# Altium project bms_mainboard-1_0.PrjPcb (part 3 of 7)

## Sheet adc_mcp3913.SchDoc
size A
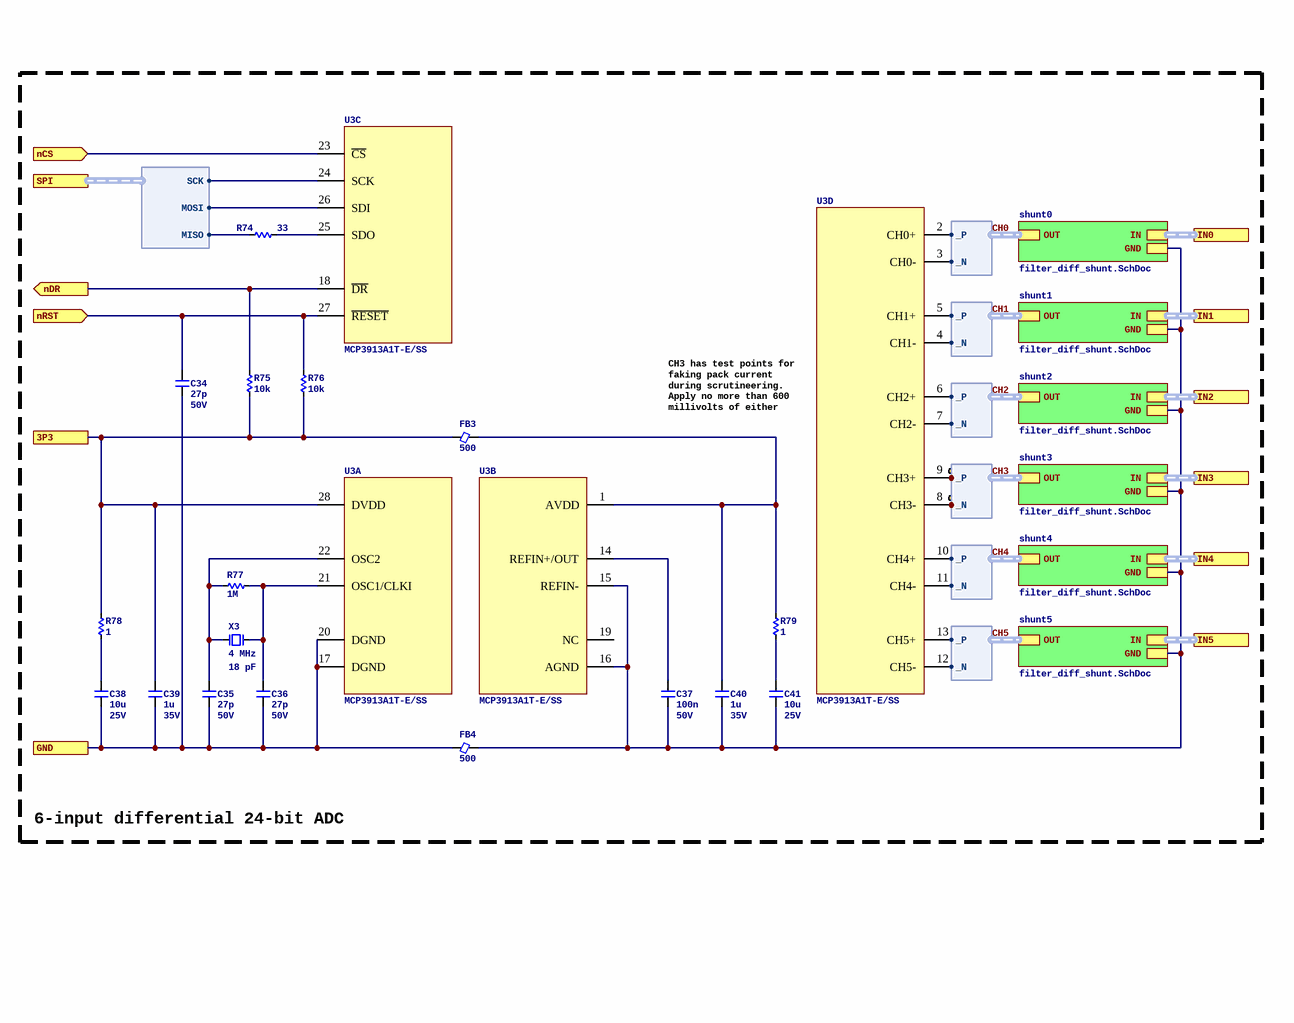
[diagram p9: adc_mcp3913.SchDoc]

### Parts
C34  Capacitance: 27p  Voltage Rating: 50V  [C0402]  (hidden comment: 0402CG270J500NT)
C35  Capacitance: 27p  Voltage Rating: 50V  [C0402]  (hidden comment: 0402CG270J500NT)
C36  Capacitance: 27p  Voltage Rating: 50V  [C0402]  (hidden comment: 0402CG270J500NT)
C37  Capacitance: 100n  Voltage Rating: 50V  [C0402]  (hidden comment: CL05B104KB54PNC)
C38  Capacitance: 10u  Voltage Rating: 25V  [C0805]  (hidden comment: CL21B106KAYQNNE)
C39  Capacitance: 1u  Voltage Rating: 35V  [C0603]  (hidden comment: GMK107AB7105KAHT)
C40  Capacitance: 1u  Voltage Rating: 35V  [C0603]  (hidden comment: GMK107AB7105KAHT)
C41  Capacitance: 10u  Voltage Rating: 25V  [C0805]  (hidden comment: CL21B106KAYQNNE)
FB3  Current Rating (mA): 500  [FB0402]  (hidden comment: BLM15AX601SN1D)
FB4  Current Rating (mA): 500  [FB0402]  (hidden comment: BLM15AX601SN1D)
R74  value 33  [R0402]  (hidden comment: 0402WGF330JTCE)
R75  value 10k  [R0402]  (hidden comment: 0402WGF1002TCE)
R76  value 10k  [R0402]  (hidden comment: 0402WGF1002TCE)
R77  value 1M  [R0402]  (hidden comment: 0402WGF1004TCE)
R78  value 1  [R0402]  (hidden comment: CRCW04021R00FKED)
R79  value 1  [R0402]  (hidden comment: CRCW04021R00FKED)
TP71  RH-5000  [TP_RH-5000]  (value not drawn)
TP72  RH-5001  [TP_RH-5001]  (value not drawn)
U3  MCP3913A1T-E/SS  [28SSOP65]  (parts A,B,C,D of 4)
X3  Frequency: 4 MHz  Load Capacitance: 18 pF  [XTAL_HC49US_SMD]  (hidden comment: ABLS2-4.000MHZ-D4Y-T)

### Blocks framed on the sheet
6-input differential 24-bit ADC: C34-C41 FB3 FB4 R74-R79 TP71 TP72 U3 X3

### Sub-sheets
shunt0 = filter_diff_shunt.SchDoc: IN (harness DIFF), OUT (harness DIFF), GND
shunt1 = filter_diff_shunt.SchDoc: IN (harness DIFF), OUT (harness DIFF), GND
shunt2 = filter_diff_shunt.SchDoc: IN (harness DIFF), OUT (harness DIFF), GND
shunt3 = filter_diff_shunt.SchDoc: IN (harness DIFF), OUT (harness DIFF), GND
shunt4 = filter_diff_shunt.SchDoc: IN (harness DIFF), OUT (harness DIFF), GND
shunt5 = filter_diff_shunt.SchDoc: IN (harness DIFF), OUT (harness DIFF), GND

### Ports
3P3, GND, IN0 (harness DIFF), IN1 (harness DIFF), IN2 (harness DIFF), IN3 (harness DIFF), IN4 (harness DIFF), IN5 (harness DIFF), nCS (in), nDR (out), nRST (in), SPI (harness SPI)

### Harnesses
DIFF: _N, _P
SPI: MISO, MOSI, SCK

### Nets
3P3_B: C39.1 FB3.1 R75.2 R76.2 R78.2 U3.28(DVDD) ; port 3P3
HV_N: C34.2 C35.2 C36.2 C38.2 C39.2 FB4.1 U3.17(DGND) U3.20(DGND) ; port GND
CH0._N: U3.3(CH0-) ; sheet shunt0/OUT._N
CH0._P: U3.2(CH0+) ; sheet shunt0/OUT._P
CH1._N: U3.4(CH1-) ; sheet shunt1/OUT._N
CH1._P: U3.5(CH1+) ; sheet shunt1/OUT._P
CH2._N: U3.7(CH2-) ; sheet shunt2/OUT._N
CH2._P: U3.6(CH2+) ; sheet shunt2/OUT._P
CH3._N: TP72.1 U3.8(CH3-) ; sheet shunt3/OUT._N
CH3._P: TP71.1 U3.9(CH3+) ; sheet shunt3/OUT._P
CH4._N: U3.11(CH4-) ; sheet shunt4/OUT._N
CH4._P: U3.10(CH4+) ; sheet shunt4/OUT._P
CH5._N: U3.12(CH5-) ; sheet shunt5/OUT._N
CH5._P: U3.13(CH5+) ; sheet shunt5/OUT._P
MCP3913_nDR_ISO: R75.1 U3.18(~{DR}) ; port nDR
MCP3913_nRST_ISO: C34.1 R76.1 U3.27(~{RESET}) ; port nRST
SPI4_ISO.MISO: R74.2 ; port SPI.MISO
SPI4_ISO.MOSI: U3.26(SDI) ; port SPI.MOSI
SPI4_ISO.SCK: U3.24(SCK) ; port SPI.SCK
SPI4_nSS_ISO: U3.23(~{CS}) ; port nCS
NetC35_1: C35.1 R77.2 U3.22(OSC2) X3.2
NetC36_1: C36.1 R77.1 U3.21(OSC1/CLKI) X3.1
NetC37_1: C37.1 U3.14(REFIN+/OUT)
NetC37_2: C37.2 C40.2 C41.2 FB4.2 U3.15(REFIN-) U3.16(AGND) ; sheet shunt0/GND, sheet shunt1/GND, sheet shunt2/GND, sheet shunt3/GND, sheet shunt4/GND, sheet shunt5/GND
NetC38_1: C38.1 R78.1
NetC40_1: C40.1 FB3.2 R79.2 U3.1(AVDD)
NetC41_1: C41.1 R79.1
NetR74_1: R74.1 U3.25(SDO)

Not connected (* = marked no-connect by the designer): U3 19(NC)

### Buses and harness runs
harness CH0 = sheet shunt0/OUT
harness CH1 = sheet shunt1/OUT
harness CH2 = sheet shunt2/OUT
harness CH3 = sheet shunt3/OUT
harness CH4 = sheet shunt4/OUT
harness CH5 = sheet shunt5/OUT
harness port IN0 = sheet shunt0/IN
harness port IN1 = sheet shunt1/IN
harness port IN2 = sheet shunt2/IN
harness port IN3 = sheet shunt3/IN
harness port IN4 = sheet shunt4/IN
harness port IN5 = sheet shunt5/IN

### Notes on the sheet
- CH3 has test points for faking pack current during scrutineering. Apply no more than 600 millivolts of either polarity.

### Library data of the parts
C34-C36 = 0402CG270J500NT: Manufacturer: FH(Guangdong Fenghua Advanced Tech); Dielectric: C0G; ComponentLink1URL: https://wmsc.lcsc.com/wmsc/upload/file/pdf/v2/lcsc/2304140030_FH--Guangdong-Fenghua-Advanced-Tech-0402CG270J500NT_C1557.pdf; ComponentLink1Description: Datasheet; Manufacturer Part Number: 0402CG270J500NT; Package: 0402; Supplier 2: LCSC; Supplier Part Number 2: C1557
C37 = CL05B104KB54PNC: Manufacturer: Samsung Electro-Mechanics; Dielectric: X7R; ComponentLink1URL: https://wmsc.lcsc.com/wmsc/upload/file/pdf/v2/lcsc/2304140030_Samsung-Electro-Mechanics-CL05B104KB54PNC_C307331.pdf; ComponentLink1Description: Datasheet; Manufacturer Part Number: CL05B104KB54PNC; Package: 0402; Supplier 2: LCSC; Supplier Part Number 2: C307331
C38 C41 = CL21B106KAYQNNE: Manufacturer: Samsung Electro-Mechanics; Dielectric: X7R; ComponentLink1URL: https://datasheet.lcsc.com/lcsc/2206222030_Samsung-Electro-Mechanics-CL21B106KAYQNNE_C3039694.pdf; ComponentLink1Description: Datasheet; Manufacturer Part Number: CL21B106KAYQNNE; Package: 0805; Supplier 2: LCSC; Supplier Part Number 2: C3039694
C39 C40 = GMK107AB7105KAHT: Manufacturer: Taiyo Yuden; Dielectric: X7R; ComponentLink1URL: https://datasheet.lcsc.com/lcsc/2304140030_Taiyo-Yuden-GMK107AB7105KAHT_C841050.pdf; ComponentLink1Description: Datasheet; Manufacturer Part Number: GMK107AB7105KAHT; Package: 0603; Supplier 2: LCSC; Supplier Part Number 2: C841050
FB3 FB4 = BLM15AX601SN1D: Manufacturer: Murata Electronics; Z @ 100 MHz: 600; DCR (mOhms): 340; ComponentLink1URL: https://wmsc.lcsc.com/wmsc/upload/file/pdf/v2/lcsc/2304140030_Murata-Electronics-BLM15AX601SN1D_C76886.pdf; ComponentLink1Description: Datasheet; Manufacturer Part Number: BLM15AX601SN1D; Supplier 2: LCSC; Supplier Part Number 2: C76886; Package: 0402
R74 = 0402WGF330JTCE: Manufacturer: UNI-ROYAL(Uniroyal Elec); Tolerance: 1%; Temperature Coefficient: Â±100ppm/â„ƒ; Power Rating (mW): 62.5; ComponentLink1Description: Datasheet; ComponentLink1URL: https://wmsc.lcsc.com/wmsc/upload/file/pdf/v2/lcsc/2205311900_UNI-ROYAL-Uniroyal-Elec-0402WGF330JTCE_C25105.pdf; Manufacturer Part Number: 0402WGF330JTCE; Package: 0402; Supplier 2: LCSC; Supplier Part Number 2: C25105
R75 R76 = 0402WGF1002TCE: Manufacturer: UNI-ROYAL(Uniroyal Elec); Tolerance: 1%; Temperature Coefficient: Â±100ppm/â„ƒ; Power Rating (mW): 62.5; ComponentLink1Description: Datasheet; ComponentLink1URL: https://wmsc.lcsc.com/wmsc/upload/file/pdf/v2/lcsc/2206010100_UNI-ROYAL-Uniroyal-Elec-0402WGF1002TCE_C25744.pdf; Manufacturer Part Number: 0402WGF1002TCE; Package: 0402; Supplier 2: LCSC; Supplier Part Number 2: C25744
R77 = 0402WGF1004TCE: Manufacturer: UNI-ROYAL(Uniroyal Elec); Tolerance: 1%; Temperature Coefficient: Â±100ppm/â„ƒ; Power Rating (mW): 62.5; ComponentLink1Description: Datasheet; ComponentLink1URL: https://wmsc.lcsc.com/wmsc/upload/file/pdf/v2/lcsc/2206010030_UNI-ROYAL-Uniroyal-Elec-0402WGF1004TCE_C26083.pdf; Manufacturer Part Number: 0402WGF1004TCE; Package: 0402; Supplier 2: LCSC; Supplier Part Number 2: C26083
R78 R79 = CRCW04021R00FKED: Manufacturer: Vishay Intertech; Tolerance: 1%; Temperature Coefficient: Â±100ppm/â„ƒ; Power Rating (mW): 63; ComponentLink1Description: Datasheet; ComponentLink1URL: https://wmsc.lcsc.com/wmsc/upload/file/pdf/v2/lcsc/2211030200_Vishay-Intertech-CRCW04021R00FKED_C482087.pdf; Manufacturer Part Number: CRCW04021R00FKED; Package: 0402; Supplier 2: LCSC; Supplier Part Number 2: C482087
TP71 = RH-5000: Manufacturer: ronghe; ComponentLink1Description: Datasheet; ComponentLink1URL: https://datasheet.lcsc.com/lcsc/2307040929_ronghe-RH-5000_C5277086.pdf; Manufacturer Part Number: RH-5000; Supplier 2: LCSC; Supplier Part Number 2: C5277086
TP72 = RH-5001: Manufacturer: ronghe; ComponentLink1Description: Datasheet; ComponentLink1URL: https://datasheet.lcsc.com/lcsc/2307040929_ronghe-RH-5000_C5277086.pdf; Manufacturer Part Number: RH-5001; Supplier 2: LCSC; Supplier Part Number 2: C5199801
U3 = ADC_MCP3913A1T-E/SS: Analog Circuit, 1 Func, PDSO28; Manufacturer: Microchip; Manufacturer Part Number: MCP3913A1T-E/SS; ComponentLink2URL: https://ww1.microchip.com/downloads/en/DeviceDoc/MCP3913-3V-Six-Channel-Analog-Front-End-DS20005227C.pdf; ComponentLink2Description: Datasheet; Supplier 1: Digikey; Supplier Part Number 1: MCP3913A1T-E/SSCT-ND; Supplier 2: LCSC; Supplier Part Number 2: C628828
X3 = XTAL_ABLS2-4.000MHZ-D4Y-T: CRYSTAL 4.000 MHZ 18PF SMD; Manufacturer: Abracon LLC; Supplier 1: Digikey; Manufacturer Part Number: ABLS2-4.000MHZ-D4Y-T; ComponentLink1URL: http://www.abracon.com/Resonators/ABLS2.pdf; ComponentLink1Description: Datasheet; Supplier Part Number 1: 535-9857-1-ND; Supplier 2: LCSC; Supplier Part Number 2: C5933228

## Sheet filter_diff_shunt.SchDoc
size A
Used 6 times, as channels adc_mcp3913/shunt0, adc_mcp3913/shunt1, adc_mcp3913/shunt2, adc_mcp3913/shunt3, adc_mcp3913/shunt4, adc_mcp3913/shunt5. Parts and nets are listed once, with the designators drawn on the sheet.
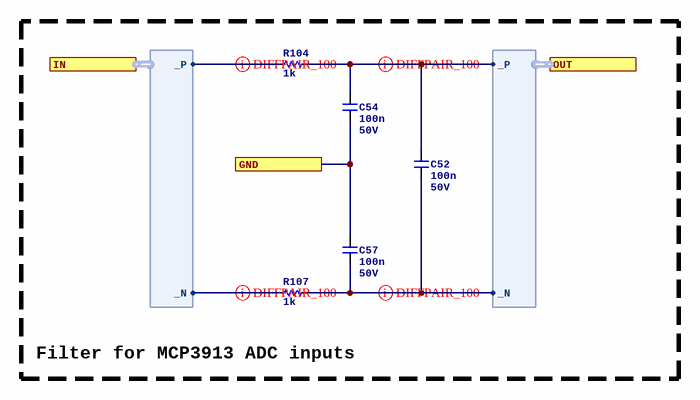
[diagram p10: filter_diff_shunt.SchDoc]

### Parts
C52  Capacitance: 100n  Voltage Rating: 50V  [C0402]  (hidden comment: CL05B104KB54PNC)
C54  Capacitance: 100n  Voltage Rating: 50V  [C0402]  (hidden comment: CL05B104KB54PNC)
C57  Capacitance: 100n  Voltage Rating: 50V  [C0402]  (hidden comment: CL05B104KB54PNC)
R104  value 1k  [R0402]  (hidden comment: 0402WGF1001TCE)
R107  value 1k  [R0402]  (hidden comment: 0402WGF1001TCE)

### Blocks framed on the sheet
Filter for MCP3913 ADC inputs: C52 C54 C57 R104 R107

### Ports
GND, IN (harness DIFF), OUT (harness DIFF)

### Harnesses
DIFF: _N, _P

### Nets
GND: C54.2 C57.1 ; port GND
NetC52_1: C52.1 C54.1 R104.1 ; port OUT._P
NetC52_2: C52.2 C57.2 R107.1 ; port OUT._N
NetR104_2: R104.2 ; port IN._P
NetR107_2: R107.2 ; port IN._N

### Channels
adc_mcp3913/shunt0: designators end in A; ports GND=NetC37_2
adc_mcp3913/shunt1: designators end in B; ports GND=NetC37_2
adc_mcp3913/shunt2: designators end in C; ports GND=NetC37_2
adc_mcp3913/shunt3: designators end in D; ports GND=NetC37_2
adc_mcp3913/shunt4: designators end in E; ports GND=NetC37_2
adc_mcp3913/shunt5: designators end in F; ports GND=NetC37_2

### Layout directives
differential pair; differential pair class DE_100: CH0._N, CH0._P, DCDC_IS._N, DCDC_IS._P

### Library data of the parts
C52 C54 C57 = CL05B104KB54PNC: as C37 on sheet adc_mcp3913; ComponentLink1URL: https://wmsc.lcsc.com/wmsc/upload/file/pdf/v2/lcsc/2304140030_Samsung-Electro-Mechanics-CL05B104KB54PNC_C307331.pdf; ComponentLink1Description: Datasheet; Manufacturer Part Number: CL05B104KB54PNC; Package: 0402; Supplier 2: LCSC; Supplier Part Number 2: C307331
R104 R107 = 0402WGF1001TCE: Manufacturer: UNI-ROYAL(Uniroyal Elec); Tolerance: 1%; Temperature Coefficient: Â±100ppm/â„ƒ; Power Rating (mW): 62.5; ComponentLink1Description: Datasheet; ComponentLink1URL: https://wmsc.lcsc.com/wmsc/upload/file/pdf/v2/lcsc/2206010216_UNI-ROYAL-Uniroyal-Elec-0402WGF1001TCE_C11702.pdf; Manufacturer Part Number: 0402WGF1001TCE; Package: 0402; Supplier 2: LCSC; Supplier Part Number 2: C11702

## Sheet hv_architecture.SchDoc
size B; SheetNumber: 3
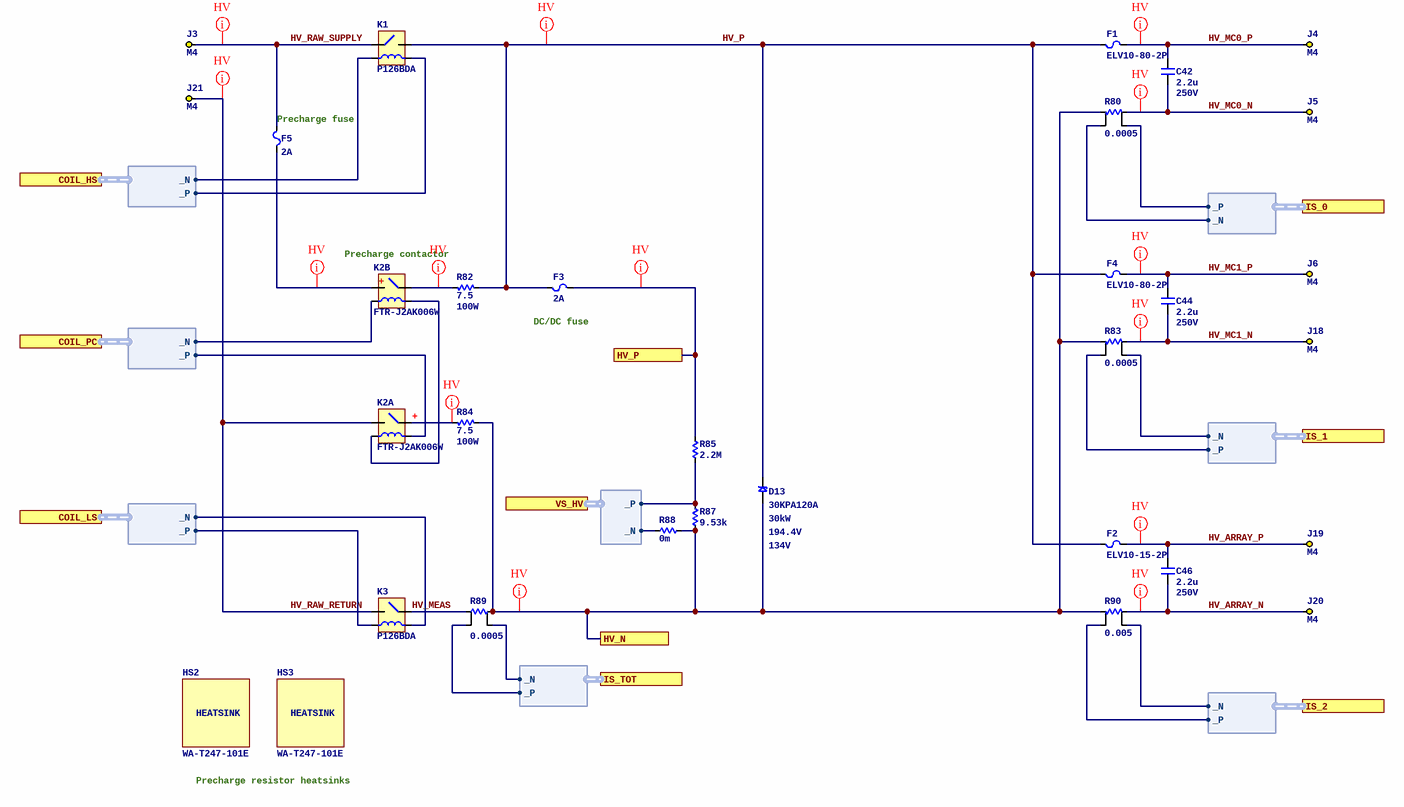
[diagram p11: hv_architecture.SchDoc]

### Parts
C42  Capacitance: 2.2u  Voltage Rating: 250V  [C2220]  (hidden comment: C5750X7T2E225KT000N)
C44  Capacitance: 2.2u  Voltage Rating: 250V  [C2220]  (hidden comment: C5750X7T2E225KT000N)
C46  Capacitance: 2.2u  Voltage Rating: 250V  [C2220]  (hidden comment: C5750X7T2E225KT000N)
D13  30KPA120A  Non-rep Peak Rev Power Dis-Max: 30kW  Clamping Voltage-Max: 194.4V  Min Breakdown Voltage: 134V  [P600_VERTICAL]
F1  ELV10-80-2P  [EATON_ELV10-xx-2P]
F2  ELV10-15-2P  [EATON_ELV10-xx-2P]
F3  Current: 2A  [BELFUSE_0ZRE0200FF]  (hidden comment: 0ZRE0200FF1A)
F4  ELV10-80-2P  [EATON_ELV10-xx-2P]
F5  Current: 2A  [BELFUSE_0ZRE0200FF]  (hidden comment: 0ZRE0200FF1A)
HS2  WA-T247-101E  (mechanical)
HS3  WA-T247-101E  (mechanical)
J3  Thread Size: M4  [WURTH_TERM_7461086]  (hidden comment: 7461086)
J4  Thread Size: M4  [WURTH_TERM_7461086]  (hidden comment: 7461086)
J5  Thread Size: M4  [WURTH_TERM_7461086]  (hidden comment: 7461086)
J6  Thread Size: M4  [WURTH_TERM_7461086]  (hidden comment: 7461086)
J18  Thread Size: M4  [WURTH_TERM_7461086]  (hidden comment: 7461086)
J19  Thread Size: M4  [WURTH_TERM_7461086]  (hidden comment: 7461086)
J20  Thread Size: M4  [WURTH_TERM_7461086]  (hidden comment: 7461086)
J21  Thread Size: M4  [WURTH_TERM_7461086]  (hidden comment: 7461086)
K1  P126BDA  [RELAY_P126]
K2  FTR-J2AK006W  [RELAY_FTR-J2]  (parts A,B of 2)
K3  P126BDA  [RELAY_P126]
R80  Resistance (Ohms): 0.0005  [VISHAY_WSL2726]  (hidden comment: WSL2726L5000FEB)
R82  Resistance (Ohms): 7.5  Power (Watts): 100W  [TO-247-2 w Ohmite heatsink]  (hidden comment: TEH100M7R50FE)
R83  Resistance (Ohms): 0.0005  [VISHAY_WSL2726]  (hidden comment: WSL2726L5000FEB)
R84  Resistance (Ohms): 7.5  Power (Watts): 100W  [TO-247-2 w Ohmite heatsink]  (hidden comment: RES_7.5_OHM_100W_1%_TO247)
R85  value 2.2M  [R1206]  (hidden comment: RC1206FR-072M2L)
R87  value 9.53k  [R0402]  (hidden comment: 0402WGF9531TCE)
R88  value 0m  [R0402]  (hidden comment: 0402WGF0000TCE)
R89  Resistance (Ohms): 0.0005  [VISHAY_WSL2726]  (hidden comment: WSL2726L5000FEB)
R90  Resistance (Ohms): 0.005  [VISHAY_WSL2726]  (hidden comment: WSL27265L000FEB)

### Ports
COIL_HS (harness DIFF), COIL_LS (harness DIFF), COIL_PC (harness DIFF), HV_N, HV_P, IS_0 (harness DIFF), IS_1 (harness DIFF), IS_2 (harness DIFF), IS_TOT (harness DIFF), VS_HV (harness DIFF)

### Harnesses
DIFF: _N, _P

### Nets
HV_N: D13.1 R80.2 R83.2 R84.2 R87.2 R88.2 R89.2 R90.2 ; port HV_N
HV_P: F3.2 R85.1 ; port HV_P
ARRAY_IS._N: R90.3 ; port IS_2._N
ARRAY_IS._P: R90.4 ; port IS_2._P
BATT_IS._N: R89.4 ; port IS_TOT._N
BATT_IS._P: R89.3 ; port IS_TOT._P
COIL_HS._N: K1.1 ; port COIL_HS._N
COIL_HS._P: K1.2 ; port COIL_HS._P
COIL_LS._N: K3.1 ; port COIL_LS._N
COIL_LS._P: K3.2 ; port COIL_LS._P
COIL_PC._N: K2.4 ; port COIL_PC._N
COIL_PC._P: K2.1 ; port COIL_PC._P
HV_ARRAY_N: C46.2 J20.0 R90.1  [project net HV_ARRAY_N_3]
HV_ARRAY_P: C46.1 F2.2 J19.0  [project net HV_ARRAY_P_3]
HV_MC0_N: C42.2 J5.0 R80.1  [project net HV_MC0_N_3]
HV_MC0_P: C42.1 F1.2 J4.0  [project net HV_MC0_P_3]
HV_MC1_N: C44.2 J18.0 R83.1  [project net HV_MC1_N_3]
HV_MC1_P: C44.1 F4.2 J6.0  [project net HV_MC1_P_3]
HV_MEAS: K3.4 R89.1  [project net HV_MEAS_3]
HV_P: D13.2 F1.1 F2.1 F3.1 F4.1 K1.3 R82.2  [project net HV_P_3]  [a separate net that carries the same name]
HV_RAW_RETURN: J21.0 K2.6 K3.3  [project net HV_RAW_RETURN_3]
HV_RAW_SUPPLY: F5.1 J3.0 K1.4  [project net HV_RAW_SUPPLY_3]
HV_VS._N: R88.1 ; port VS_HV._N
HV_VS._P: R85.2 R87.1 ; port VS_HV._P
MC0_IS._N: R80.4 ; port IS_0._N
MC0_IS._P: R80.3 ; port IS_0._P
MC1_IS._N: R83.3 ; port IS_1._N
MC1_IS._P: R83.4 ; port IS_1._P
NetF5_2: F5.2 K2.8
NetK2_2: K2.2 K2.3
NetK2_5: K2.5 R84.1
NetK2_7: K2.7 R82.1

### Layout directives
net class HV: HV_ARRAY_N_3, HV_ARRAY_P_3, HV_MC0_N_3, HV_MC0_P_3, HV_MC1_N_3, HV_MC1_P_3, HV_N, HV_P, HV_P_3, HV_RAW_RETURN_3, HV_RAW_SUPPLY_3, NetF5_2, NetK2_5, NetK2_7

### Notes on the sheet
- (near F5) Precharge fuse
- Precharge contactor
- (near F3) DC/DC fuse
- Precharge resistor heatsinks
- (in symbol HEATSINK_OHMITE_WA-T247-101E) HEATSINK
- (in symbol RELAY_FTR-J2AK006W, part A) +
- (in symbol RELAY_FTR-J2AK006W, part B) +
- (in symbol FTR-J2AK006W, part A) +
- (in symbol FTR-J2AK006W, part B) +
- (in symbol WA-T247-101E) HEATSINK

### Library data of the parts
C42 C44 C46 = C5750X7T2E225KT000N: Manufacturer: TDK; Dielectric: X7T; ComponentLink1URL: https://wmsc.lcsc.com/wmsc/upload/file/pdf/v2/lcsc/2304140030_TDK-C5750X7T2E225KT000N_C435266.pdf; ComponentLink1Description: Datasheet; Manufacturer Part Number: C5750X7T2E225KT000N; Package: 2220; Supplier 2: LCSC; Supplier Part Number 2: C435266
D13 = TVS_UNI_30KPA120A: Trans Voltage Suppressor Diode, 30000W, 120V V(RWM), Unidirectional, 1 Element, Silicon; Manufacturer: Littelfuse; Supplier 1: Digikey; Supplier Part Number 1: 30KPA120A-ND; Manufacturer Part Number: 30KPA120A; ComponentLink1URL: https://mm.digikey.com/Volume0/opasdata/d220001/medias/docus/4180/30KPA_Series.pdf; ComponentLink1Description: Datasheet; Supplier 2: LCSC; Supplier Part Number 2: C1984717
F1 F4 = FUSE_EATON_ELV10-80-2P: FUSE EV 80A 200VDC 2P TERM; Manufacturer: Eaton; Supplier 1: Digikey; Supplier Part Number 1: 283-ELV10-80-2P-ND; Manufacturer Part Number: ELV10-80-2P; ComponentLink1Description: Datasheet; ComponentLink1URL: https://www.eaton.com/content/dam/eaton/products/electronic-components/resources/data-sheet/eaton-elv10-10x25mm-ev-fuse-data-sheet-elx1302-en.pdf
F2 = FUSE_EATON_ELV10-15-2P: 15A 200 VDC Fuse Cartridge Through Hole; Manufacturer: Eaton; Supplier 1: Digikey; Supplier Part Number 1: 283-ELV10-15-2P-ND; Manufacturer Part Number: ELV10-15-2P; ComponentLink1Description: Datasheet; ComponentLink1URL: https://www.eaton.com/content/dam/eaton/products/electronic-components/resources/data-sheet/eaton-elv10-10x25mm-ev-fuse-data-sheet-elx1302-en.pdf
F3 F5 = PTC_BELFUSE_0ZRE0200FF1A: Polymeric PTC Resettable Fuse 240V 2 A Ih Through Hole Radial, Disc; Manufacturer: Bel Fuse Inc.; Supplier 1: Digikey; Supplier Part Number 1: 5923-0ZRE0200FF1A-ND; Manufacturer Part Number: 0ZRE0200FF1A; Supplier 2: LCSC; ComponentLink1Description: Datasheet; ComponentLink1URL: https://www.belfuse.com/media/datasheets/products/circuit-protection/ds-cp-0zre-series.pdf
HS2 HS3 = HEATSINK_OHMITE_WA-T247-101E: Heat Sink, 11ohm, Extruded, Clip, Longitudinal, Aluminum Alloy, Anodized; Manufacturer: Ohmite; Supplier 1: Digikey; Supplier Part Number 1: WA-T247-101E-ND; Manufacturer Part Number: WA-T247-101E; ComponentLink1Description: Datasheet; ComponentLink1URL: https://www.ohmite.com/assets/images/sink-w.pdf
J3-J6 J18-J21 = CONN_WURTH_7461086: POWER ELEMENT BUSH M4 12PIN; Manufacturer: Wurth Electronics; Supplier 1: Digikey; Supplier Part Number 1: 732-3207-ND; Manufacturer Part Number: 7461086
K1 K3 = RELAY_P126BDA: RELAY GEN PURPOSE SPST 60A 12V; Manufacturer: Sensata; Supplier 1: Digikey; Supplier Part Number 1: 3596-P126BDA-ND; Manufacturer Part Number: P126BDA; Supplier 2: Mouser; Supplier Part Number 2: 682-P126BDA; ComponentLink1Description: Datasheet; ComponentLink1URL: https://www.sensata.com/sites/default/files/a/sensata-gigavac-p126-series-minitactor-contactors-datasheet.pdf
K2 = RELAY_FTR-J2AK006W: General Purpose Relay 450VDC/10A; Manufacturer: Fujitsu; Supplier 1: Verical; Supplier Part Number 1: FTR-J2AK006W; Manufacturer Part Number: FTR-J2AK006W; ComponentLink1URL: https://www.fcl-components.com/downloads/MICRO/fcai/relays/ftr-j2.pdf; ComponentLink1Description: Datasheet; Supplier 2: Mouser; Supplier Part Number 2: 817-FTR-J2AK006W
R80 R83 R89 = RES_CURRENT_SENSE_0.0005_OHM_1%_3W_2726_WSL2726L5000FEB: RES SMD 0.0005 OHM 1% 3W 2726; Manufacturer: Vishay Dale; Supplier 1: Digikey; Manufacturer Part Number: WSL2726L5000FEB; ComponentLink1URL: http://www.vishay.com/docs/30131/wsl2726.pdf; ComponentLink1Description: Datasheet; Supplier Part Number 1: WSLQ-.0005CT-ND; Supplier 2: LCSC; Supplier Part Number 2: C4132421
R82 = RES_7.5_OHM_100W_1%_TO247: RES TK FM 7.5 OHM 100W 1% TO247; Manufacturer: Ohmite; Supplier 1: Digikey; Manufacturer Part Number: TEH100M7R50FE; ComponentLink1URL: http://www.ohmite.com/cat/res_teh100.pdf; ComponentLink1Description: Datasheet; Supplier Part Number 1: TEH100M7R50FE-ND; Supplier 2: LCSC; Supplier Part Number 2: C2641795
R84 = RES_7.5_OHM_100W_1%_TO247: RES TK FM 7.5 OHM 100W 1% TO247; Manufacturer: Ohmite; Manufacturer Part Number: TEH100M7R50FE; Supplier 1: Digikey; ComponentLink1URL: http://www.ohmite.com/cat/res_teh100.pdf; ComponentLink1Description: Datasheet; Supplier Part Number 1: TEH100M7R50FE-ND; Supplier 2: LCSC; Supplier Part Number 2: C2641795
R85 = RC1206FR-072M2L: Manufacturer: YAGEO; Tolerance: 1%; Temperature Coefficient: Â±100ppm/â„ƒ; Power Rating (mW): 250; ComponentLink1Description: Datasheet; ComponentLink1URL: https://wmsc.lcsc.com/wmsc/upload/file/pdf/v2/lcsc/2304140030_YAGEO-RC1206FR-072M2L_C137329.pdf; Manufacturer Part Number: RC1206FR-072M2L; Package: 1206; Supplier 2: LCSC; Supplier Part Number 2: C137329
R87 = 0402WGF9531TCE: Manufacturer: UNI-ROYAL(Uniroyal Elec); Tolerance: 1%; Temperature Coefficient: Â±100ppm/â„ƒ; Power Rating (mW): 62.5; ComponentLink1Description: Datasheet; ComponentLink1URL: https://wmsc.lcsc.com/wmsc/upload/file/pdf/v2/lcsc/2205312316_UNI-ROYAL-Uniroyal-Elec-0402WGF9531TCE_C96273.pdf; Manufacturer Part Number: 0402WGF9531TCE; Package: 0402; Supplier 2: LCSC; Supplier Part Number 2: C96273
R88 = 0402WGF0000TCE: Manufacturer: UNI-ROYAL(Uniroyal Elec); Power Rating (mW): 62.5; ComponentLink1Description: Datasheet; ComponentLink1URL: https://wmsc.lcsc.com/wmsc/upload/file/pdf/v2/lcsc/2206010216_UNI-ROYAL-Uniroyal-Elec-0402WGF0000TCE_C17168.pdf; Manufacturer Part Number: 0402WGF0000TCE; Package: 0402; Supplier 2: LCSC; Supplier Part Number 2: C17168
R90 = RES_CURRENT_SENSE_0.005_OHM_1%_3W_2726_WSL27265L000FEB: RES SMD 0.005 OHM 1% 3W 2726; Manufacturer: Vishay Dale; Supplier 1: Digikey; Manufacturer Part Number: WSL27265L000FEB; ComponentLink1URL: http://www.vishay.com/docs/30131/wsl2726.pdf; ComponentLink1Description: Datasheet; Supplier Part Number 1: WSLQ-.005CT-ND; Supplier 2: LCSC; Supplier Part Number 2: C1517421

## Sheet conn_fan.SchDoc
size A
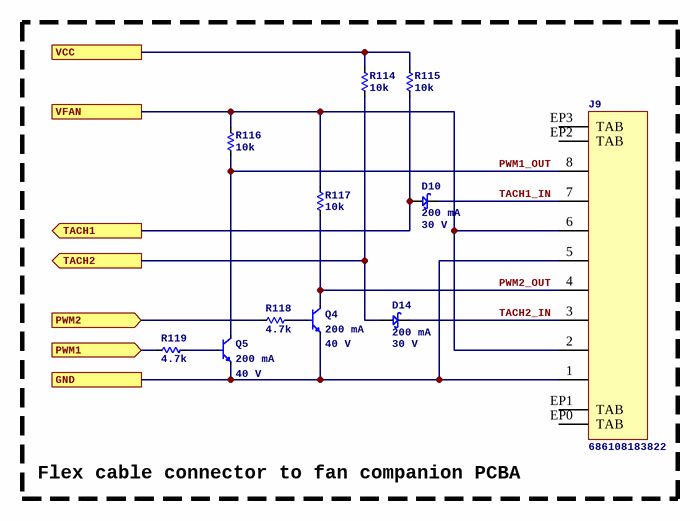
[diagram p12: conn_fan.SchDoc]

### Parts
D10  Current: 200 mA  Voltage: 30 V  [SOD523]  (hidden comment: BAT54XV2T1G)
D14  Current: 200 mA  Voltage: 30 V  [SOD523]  (hidden comment: BAT54XV2T1G)
J9  686108183822  [WURTH_WR-FPC_1.00mm_686108183822]
Q4  Current: 200 mA  Voltage: 40 V  [3SOT523]  (hidden comment: MMBT3904T)
Q5  Current: 200 mA  Voltage: 40 V  [3SOT523]  (hidden comment: MMBT3904T)
R114  value 10k  [R0402]  (hidden comment: 0402WGF1002TCE)
R115  value 10k  [R0402]  (hidden comment: 0402WGF1002TCE)
R116  value 10k  [R0402]  (hidden comment: 0402WGF1002TCE)
R117  value 10k  [R0402]  (hidden comment: 0402WGF1002TCE)
R118  value 4.7k  [R0402]  (hidden comment: 0402WGF4701TCE)
R119  value 4.7k  [R0402]  (hidden comment: 0402WGF4701TCE)

### Blocks framed on the sheet
Flex cable connector to fan companion PCBA: D10 D14 J9 Q4 Q5 R114-R119

### Ports
GND, PWM1 (in), PWM2 (in), TACH1 (out), TACH2 (out), VCC, VFAN

### Nets
3P3: R114.1 R115.1 ; port VCC
GND: J9.1 J9.5 Q4.2(E) Q5.2(E) ; port GND
LV_FAN: J9.2 J9.6 R116.1 R117.1 ; port VFAN
FAN1_PWM: R119.2 ; port PWM1
FAN1_TACH: D10.1 R115.2 ; port TACH1
FAN2_PWM: R118.2 ; port PWM2
FAN2_TACH: D14.1 R114.2 ; port TACH2
PWM1_OUT: J9.8 Q5.3(C) R116.2
PWM2_OUT: J9.4 Q4.3(C) R117.2
TACH1_IN: D10.2 J9.7
TACH2_IN: D14.2 J9.3
NetQ4_1: Q4.1(B) R118.1
NetQ5_1: Q5.1(B) R119.1

Not connected (* = marked no-connect by the designer): J9 EP0(TAB) EP1(TAB) EP2(TAB) EP3(TAB)

### Library data of the parts
D10 D14 = SCHOTTKY_30V_BAT54XV2T1G: ON Semi BAT54XV2T1G; SMT Schottky Diode; 30V 200mA; 5ns; 2-Pin SOD-523; Manufacturer: onsemi; Supplier 1: DigiKey; Supplier Part Number 1: BAT54XV2T1GOSCT-ND; Manufacturer Part Number: BAT54XV2T1G; Supplier 2: LCSC; Supplier Part Number 2: C81572; ComponentLink1Description: Datasheet; ComponentLink1URL: https://www.onsemi.com/pdf/datasheet/bat54xv2t1-d.pdf
J9 = CONN_WURTH_WR-FPC_8POS_1.00mm_686108183822: CONN FFC VERT 8POS 1MM SMD; Manufacturer: Wurth Elektronik; Supplier 1: Digikey; Supplier Part Number 1: 732-6018-1-ND; Manufacturer Part Number: 686108183822; Supplier 2: Mouser; Supplier Part Number 2: 710-686108183822; ComponentLink1Description: Drawing; ComponentLink1URL: https://www.we-online.com/components/products/datasheet/686104148922.pdf
Q4 Q5 = NPN_40V_MMBT3904T: Bipolar (BJT) Transistor NPN 40 V 200 mA 300MHz 150 mW Surface Mount SOT-523; Manufacturer: Shenzhen Slkormicro Semicon Co., Ltd.; Supplier 1: Digikey; Supplier Part Number 1: 5399-MMBT3904TCT-ND; Manufacturer Part Number: MMBT3904T; ComponentLink1Description: Datasheet; ComponentLink1URL: https://mm.digikey.com/Volume0/opasdata/d220001/medias/docus/7136/5399_MMBT3904T%20SOT-523.pdf; Supplier 2: LCSC; Supplier Part Number 2: C61616
R114-R117 = 0402WGF1002TCE: as R75 on sheet adc_mcp3913; ComponentLink1Description: Datasheet; ComponentLink1URL: https://wmsc.lcsc.com/wmsc/upload/file/pdf/v2/lcsc/2206010100_UNI-ROYAL-Uniroyal-Elec-0402WGF1002TCE_C25744.pdf; Manufacturer Part Number: 0402WGF1002TCE; Package: 0402; Supplier 2: LCSC; Supplier Part Number 2: C25744
R118 R119 = 0402WGF4701TCE: Manufacturer: UNI-ROYAL(Uniroyal Elec); Tolerance: 1%; Temperature Coefficient: Â±100ppm/â„ƒ; Power Rating (mW): 62.5; ComponentLink1Description: Datasheet; ComponentLink1URL: https://wmsc.lcsc.com/wmsc/upload/file/pdf/v2/lcsc/2206010045_UNI-ROYAL-Uniroyal-Elec-0402WGF4701TCE_C25900.pdf; Manufacturer Part Number: 0402WGF4701TCE; Package: 0402; Supplier 2: LCSC; Supplier Part Number 2: C25900

## Sheet hv_bleed.SchDoc
size A
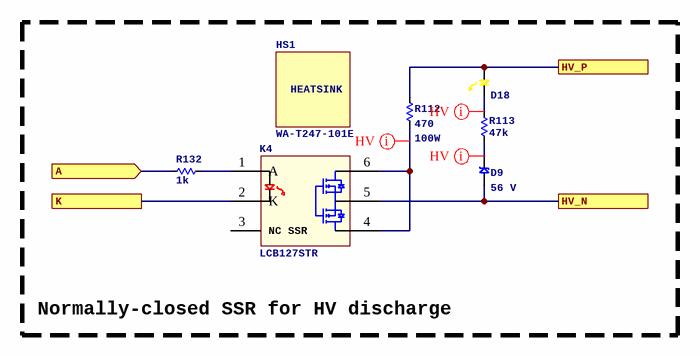
[diagram p13: hv_bleed.SchDoc]

### Parts
D9  Voltage - Zener (Nom) (Vz): 56 V  [SOD323]  (hidden comment: MM3Z56VC)
D18  LTST-C190YKT  [LED_0603P_YELLOW]  (value not drawn)
HS1  WA-T247-101E  [OHMITE_WA-T247-101E]
K4  LCB127STR  [6SMD300]
R112  Resistance (Ohms): 470  Power (Watts): 100W  [TO-247-2_VERTICAL]  (hidden comment: TEH100M470RJE)
R113  value 47k  [R0402]  (hidden comment: 0402WGF4702TCE)
R132  value 1k  [R0402]  (hidden comment: 0402WGF1001TCE)

### Blocks framed on the sheet
Normally-closed SSR for HV discharge: D9 D18 HS1 K4 R112 R113 R132

### Ports
A (in), HV_N, HV_P, K

### Nets
GND: K4.2(K) ; port K
HV_N: D9.1 K4.5 ; port HV_N
HV_P: D18.2 R112.2 ; port HV_P
HV_nBLEED: R132.2 ; port A
NetD9_2: D9.2 R113.2
NetD18_1: D18.1 R113.1
NetK4_1: K4.1(A) R132.1
NetK4_4: K4.4 K4.6 R112.1

Not connected (* = marked no-connect by the designer): K4 3

### Layout directives
net class HV: NetD9_2, NetD18_1, NetK4_4

### Notes on the sheet
- (in symbol HEATSINK_OHMITE_WA-T247-101E) HEATSINK
- (in symbol SSR_250V_LCB127STR) NC SSR
- (in symbol LCB127STR) NC SSR
- (in symbol WA-T247-101E) HEATSINK

### Library data of the parts
D9 = ZENER_MM3Z56VC: DIODE ZENER 56V 200MW SOD; Manufacturer: onsemi; Supplier 1: Digikey; Manufacturer Part Number: MM3Z56VC; ComponentLink1URL: https://www.onsemi.com/pdf/datasheet/mm3z9v1c-d.pdf; ComponentLink1Description: Datasheet; Supplier Part Number 1: 488-MM3Z56VCCT-ND; Supplier 2: LCSC; Supplier Part Number 2: C891632
D18 = LED_0603_YELLOW_LTST-C190YKT: LED YELLOW CLEAR 0603 SMD; Manufacturer: Lite-On Inc; Supplier 1: Digikey; ComponentLink1URL: https://mm.digikey.com/Volume0/opasdata/d220001/medias/docus/1176/LTST-C190YKT.pdf; ComponentLink1Description: Datasheet; Supplier Part Number 1: 160-1184-1-ND; Manufacturer Part Number: LTST-C190YKT; Supplier 2: LCSC; Supplier Part Number 2: C125097
HS1 = HEATSINK_OHMITE_WA-T247-101E: as HS2 on sheet hv_architecture; Supplier 1: Digikey; Supplier Part Number 1: WA-T247-101E-ND; Manufacturer Part Number: WA-T247-101E; ComponentLink1Description: Datasheet; ComponentLink1URL: https://www.ohmite.com/assets/images/sink-w.pdf
K4 = SSR_250V_LCB127STR: Relay Ssr 50MA 1.4V Dc-in 0.2A 250V Ac/dc-out 6-PIN PDIP SMD T/r; Manufacturer: IXYS; Supplier 1: Digikey; Supplier Part Number 1: 212-LCB127STRCT-ND; Manufacturer Part Number: LCB127STR; ComponentLink1Description: Datasheet; ComponentLink1URL: https://www.littelfuse.com/assetdocs/littelfuse-integrated-circuits-lcb127-datasheet?assetguid=ed9c03ce-9d8a-4952-b2f0-cdedc4b0af1f; Supplier 2: LCSC; Supplier Part Number 2: C6286119
R112 = RES_470_OHM_100W_1%_TO247: RES TK FM 470 OHM 100W 1% TO247; Manufacturer: Ohmite; Supplier 1: Digikey; Manufacturer Part Number: TEH100M470RJE; ComponentLink1URL: http://www.ohmite.com/cat/res_teh100.pdf; ComponentLink1Description: Datasheet; Supplier Part Number 1: TEH100M470RJE-ND; Supplier 2: LCSC; Supplier Part Number 2: C2642463
R113 = 0402WGF4702TCE: Manufacturer: UNI-ROYAL(Uniroyal Elec); Tolerance: 1%; Temperature Coefficient: Â±100ppm/â„ƒ; Power Rating (mW): 62.5; Manufacturer Part Number: 0402WGF4702TCE; ComponentLink1Description: Datasheet; ComponentLink1URL: https://wmsc.lcsc.com/wmsc/upload/file/pdf/v2/lcsc/2206010100_UNI-ROYAL-Uniroyal-Elec-0402WGF4702TCE_C25792.pdf; Package: 0402; Supplier 2: LCSC; Supplier Part Number 2: C25792
R132 = 0402WGF1001TCE: as R104 on sheet filter_diff_shunt; ComponentLink1Description: Datasheet; ComponentLink1URL: https://wmsc.lcsc.com/wmsc/upload/file/pdf/v2/lcsc/2206010216_UNI-ROYAL-Uniroyal-Elec-0402WGF1001TCE_C11702.pdf; Manufacturer Part Number: 0402WGF1001TCE; Package: 0402; Supplier 2: LCSC; Supplier Part Number 2: C11702

## Sheet current_mp6519.SchDoc
size A
Used 3 times, as channels current_coil_hs, current_coil_ls, current_coil_pc. Parts and nets are listed once, with the designators drawn on the sheet.
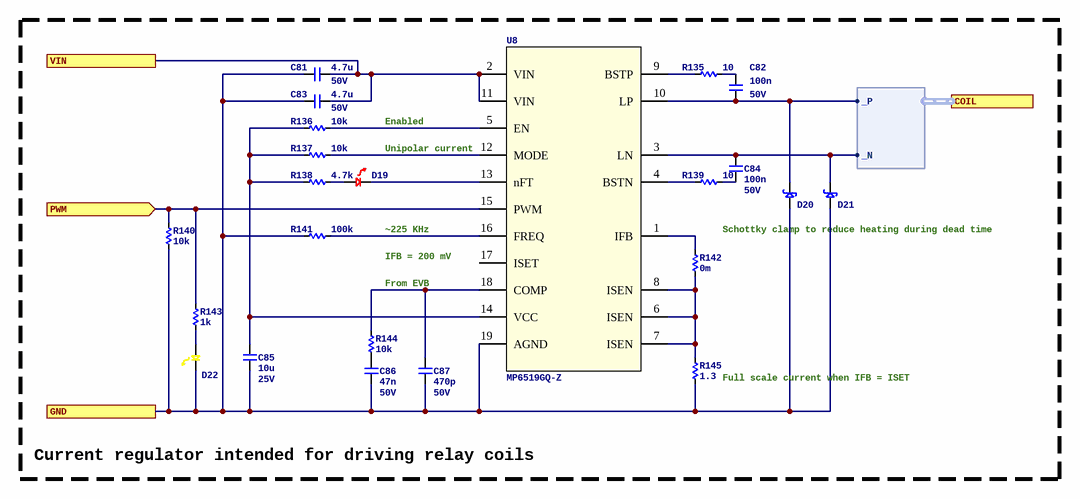
[diagram p14: current_mp6519.SchDoc]

### Parts
C81  Capacitance: 4.7u  Voltage Rating: 50V  [C0805]  (hidden comment: 0805B475K500NT)
C82  Capacitance: 100n  Voltage Rating: 50V  [C0402]  (hidden comment: CL05B104KB54PNC)
C83  Capacitance: 4.7u  Voltage Rating: 50V  [C0805]  (hidden comment: 0805B475K500NT)
C84  Capacitance: 100n  Voltage Rating: 50V  [C0402]  (hidden comment: CL05B104KB54PNC)
C85  Capacitance: 10u  Voltage Rating: 25V  [C0603]  (hidden comment: CL10A106MA8NRNC)
C86  Capacitance: 47n  Voltage Rating: 50V  [C0402]  (hidden comment: 0402B473K500NT)
C87  Capacitance: 470p  Voltage Rating: 50V  [C0402]  (hidden comment: GRM1555C1H471JA01D)
D19  LTST-C190KRKT  [LED_0603P_RED]  (value not drawn)
D20  MSS2P2-M3/89A  [ESMP]  (value not drawn)
D21  MSS2P2-M3/89A  [ESMP]  (value not drawn)
D22  LTST-C190YKT  [LED_0603P_YELLOW]  (value not drawn)
R135  value 10  [R0402]  (hidden comment: FRC0402F10R0TS)
R136  value 10k  [R0402]  (hidden comment: 0402WGF1002TCE)
R137  value 10k  [R0402]  (hidden comment: 0402WGF1002TCE)
R138  value 4.7k  [R0402]  (hidden comment: 0402WGF4701TCE)
R139  value 10  [R0402]  (hidden comment: FRC0402F10R0TS)
R140  value 10k  [R0402]  (hidden comment: 0402WGF1002TCE)
R141  value 100k  [R0402]  (hidden comment: 0402WGF1003TCE)
R142  value 0m  [R0402]  (hidden comment: 0402WGF0000TCE)
R143  value 1k  [R0402]  (hidden comment: 0402WGF1001TCE)
R144  value 10k  [R0402]  (hidden comment: 0402WGF1002TCE)
R145  value 1.3  [R1206]  (hidden comment: HP06W2F130KT5E)
U8  MP6519GQ-Z  [MP6519]

### Ports
COIL (harness DIFF), GND, PWM (in), VIN

### Harnesses
DIFF: _N, _P

### Nets
GND: C81.1 C83.1 C85.2 C86.2 C87.2 D20.2 D21.2 D22.1 R140.1 R141.2 R145.1 U8.19(AGND) ; port GND
PWM: R140.2 R143.1 U8.15(PWM) ; port PWM
VIN: C81.2 C83.2 U8.2(VIN) U8.11(VIN) ; port VIN
NetC82_1: C82.1 R135.2
NetC82_2: C82.2 D20.1 U8.10(LP) ; port COIL._P
NetC84_1: C84.1 D21.1 U8.3(LN) ; port COIL._N
NetC84_2: C84.2 R139.2
NetC85_1: C85.1 R136.1 R137.1 R138.1 U8.14(VCC)
NetC86_1: C86.1 R144.1
NetC87_1: C87.1 R144.2 U8.18(COMP)
NetD19_1: D19.1 U8.13(nFT)
NetD19_2: D19.2 R138.2
NetD22_2: D22.2 R143.2
NetR135_1: R135.1 U8.9(BSTP)
NetR136_2: R136.2 U8.5(EN)
NetR137_2: R137.2 U8.12(MODE)
NetR139_1: R139.1 U8.4(BSTN)
NetR141_1: R141.1 U8.16(FREQ)
NetR142_1: R142.1 R145.2 U8.6(ISEN) U8.7(ISEN) U8.8(ISEN)
NetR142_2: R142.2 U8.1(IFB)

Not connected (* = marked no-connect by the designer): U8 17(ISET)

### Channels
current_coil_hs: designators end in A; ports GND=GND PWM=HS_CONTACTOR VIN=LV_COIL
current_coil_ls: designators end in B; ports GND=GND PWM=LS_CONTACTOR VIN=LV_COIL
current_coil_pc: designators end in C; ports GND=GND PWM=PC_RELAY VIN=LV_COIL

### Notes on the sheet
- Enabled
- Unipolar current
- ~225 KHz
- IFB = 200 mV
- Schottky clamp to reduce heating during dead time
- From EVB
- (near R145) Full scale current when IFB = ISET
- Current regulator intended for driving relay coils

### Library data of the parts
C81 C83 = 0805B475K500NT: Manufacturer: FH (Guangdong Fenghua Advanced Tech); Dielectric: X7R; ComponentLink1URL: https://wmsc.lcsc.com/wmsc/upload/file/pdf/v2/lcsc/2204111630_FH--Guangdong-Fenghua-Advanced-Tech-0805B475K500NT_C2991173.pdf; ComponentLink1Description: Datasheet; Manufacturer Part Number: 0805B475K500NT; Package: 0805; Supplier 2: LCSC; Supplier Part Number 2: C2991173
C82 C84 = CL05B104KB54PNC: as C37 on sheet adc_mcp3913; ComponentLink1URL: https://wmsc.lcsc.com/wmsc/upload/file/pdf/v2/lcsc/2304140030_Samsung-Electro-Mechanics-CL05B104KB54PNC_C307331.pdf; ComponentLink1Description: Datasheet; Manufacturer Part Number: CL05B104KB54PNC; Package: 0402; Supplier 2: LCSC; Supplier Part Number 2: C307331
C85 = CL10A106MA8NRNC: Manufacturer: Samsung Electro-Mechanics; Dielectric: X5R; ComponentLink1URL: https://wmsc.lcsc.com/wmsc/upload/file/pdf/v2/lcsc/2304140030_Samsung-Electro-Mechanics-CL10A106MA8NRNC_C96446.pdf; ComponentLink1Description: Datasheet; Manufacturer Part Number: CL10A106MA8NRNC; Package: 0603; Supplier 2: LCSC; Supplier Part Number 2: C96446
C86 = 0402B473K500NT: Manufacturer: FH(Guangdong Fenghua Advanced Tech); Dielectric: X7R; ComponentLink1URL: https://wmsc.lcsc.com/wmsc/upload/file/pdf/v2/lcsc/2304140030_FH--Guangdong-Fenghua-Advanced-Tech-0402B473K500NT_C82219.pdf; ComponentLink1Description: Datasheet; Manufacturer Part Number: 0402B473K500NT; Package: 0402; Supplier 2: LCSC; Supplier Part Number 2: C82219
C87 = GRM1555C1H471JA01D: Manufacturer: Murata Electronics; Dielectric: C0G; ComponentLink1URL: https://wmsc.lcsc.com/wmsc/upload/file/pdf/v2/lcsc/1811081616_Murata-Electronics-GRM1555C1H471JA01D_C76971.pdf; ComponentLink1Description: Datasheet; Manufacturer Part Number: GRM1555C1H471JA01D; Package: 0402; Supplier 2: LCSC; Supplier Part Number 2: C76971
D19 = LED_0603_RED_LTST-C190KRKT: LED SUPER RED CLEAR 0603 SMD; Manufacturer: Lite-On Inc; ComponentLink1URL: https://optoelectronics.liteon.com/upload/download/DS-22-99-0151/LTST-C190KRKT.pdf; ComponentLink1Description: Datasheet; Supplier 1: Digikey; Supplier Part Number 1: 160-1436-1-ND; Manufacturer Part Number: LTST-C190KRKT; Supplier 2: LCSC; Supplier Part Number 2: C94869
D20 D21 = SCHOTTKY_MSS2P2-M3/89A: DIODE SCHOTTKY 20V 2A MICROSMP; Manufacturer: Vishay Semiconductor Diodes Division; Supplier 1: Digikey; Manufacturer Part Number: MSS2P2-M3/89A; ComponentLink1URL: http://www.vishay.com/docs/89054/mss2p3.pdf; ComponentLink1Description: Datasheet; Supplier Part Number 1: MSS2P2-M3/89AGICT-ND; Supplier 2: LCSC; Supplier Part Number 2: C2978531
D22 = LED_0603_YELLOW_LTST-C190YKT: as D18 on sheet hv_bleed; Supplier 1: Digikey; ComponentLink1URL: https://mm.digikey.com/Volume0/opasdata/d220001/medias/docus/1176/LTST-C190YKT.pdf; ComponentLink1Description: Datasheet; Supplier Part Number 1: 160-1184-1-ND; Manufacturer Part Number: LTST-C190YKT; Supplier 2: LCSC; Supplier Part Number 2: C125097
R135 R139 = FRC0402F10R0TS: Manufacturer: FOJAN; Tolerance: 1%; Temperature Coefficient: Â±100ppm/â„ƒ; Power Rating (mW): 62.5; ComponentLink1Description: Datasheet; ComponentLink1URL: https://datasheet.lcsc.com/lcsc/2308241947_FOJAN-FRC0402F10R0TS_C2906862.pdf; Manufacturer Part Number: FRC0402F10R0TS; Package: 0402; Supplier 2: LCSC; Supplier Part Number 2: C2906862
R136 R137 R140 R144 = 0402WGF1002TCE: as R75 on sheet adc_mcp3913; ComponentLink1Description: Datasheet; ComponentLink1URL: https://wmsc.lcsc.com/wmsc/upload/file/pdf/v2/lcsc/2206010100_UNI-ROYAL-Uniroyal-Elec-0402WGF1002TCE_C25744.pdf; Manufacturer Part Number: 0402WGF1002TCE; Package: 0402; Supplier 2: LCSC; Supplier Part Number 2: C25744
R138 = 0402WGF4701TCE: as R118 on sheet conn_fan; ComponentLink1Description: Datasheet; ComponentLink1URL: https://wmsc.lcsc.com/wmsc/upload/file/pdf/v2/lcsc/2206010045_UNI-ROYAL-Uniroyal-Elec-0402WGF4701TCE_C25900.pdf; Manufacturer Part Number: 0402WGF4701TCE; Package: 0402; Supplier 2: LCSC; Supplier Part Number 2: C25900
R141 = 0402WGF1003TCE: Manufacturer: UNI-ROYAL(Uniroyal Elec); Tolerance: 1%; Temperature Coefficient: Â±100ppm/â„ƒ; Power Rating (mW): 62.5; ComponentLink1Description: Datasheet; ComponentLink1URL: https://wmsc.lcsc.com/wmsc/upload/file/pdf/v2/lcsc/2206010100_UNI-ROYAL-Uniroyal-Elec-0402WGF1003TCE_C25741.pdf; Manufacturer Part Number: 0402WGF1003TCE; Package: 0402; Supplier 2: LCSC; Supplier Part Number 2: C25741
R142 = 0402WGF0000TCE: as R88 on sheet hv_architecture; ComponentLink1Description: Datasheet; ComponentLink1URL: https://wmsc.lcsc.com/wmsc/upload/file/pdf/v2/lcsc/2206010216_UNI-ROYAL-Uniroyal-Elec-0402WGF0000TCE_C17168.pdf; Manufacturer Part Number: 0402WGF0000TCE; Package: 0402; Supplier 2: LCSC; Supplier Part Number 2: C17168
R143 = 0402WGF1001TCE: as R104 on sheet filter_diff_shunt; ComponentLink1Description: Datasheet; ComponentLink1URL: https://wmsc.lcsc.com/wmsc/upload/file/pdf/v2/lcsc/2206010216_UNI-ROYAL-Uniroyal-Elec-0402WGF1001TCE_C11702.pdf; Manufacturer Part Number: 0402WGF1001TCE; Package: 0402; Supplier 2: LCSC; Supplier Part Number 2: C11702
R145 = HP06W2F130KT5E: Manufacturer: UNI-ROYAL(Uniroyal Elec); Tolerance: 1%; Temperature Coefficient: Â±100ppm/â„ƒ; Power Rating (mW): 500; ComponentLink1Description: Datasheet; ComponentLink1URL: https://wmsc.lcsc.com/wmsc/upload/file/pdf/v2/lcsc/2304140030_UNI-ROYAL-Uniroyal-Elec-HP06W2F130KT5E_C414957.pdf; Manufacturer Part Number: HP06W2F130KT5E; Package: 1206; Supplier 2: LCSC; Supplier Part Number 2: C414957
U8 = CURRENT_BRIDGE_MP6519GQ-Z: 2.5V - 28V, 5A, H-bridge Current Regulator; Manufacturer: Monolithic Power Systems; Supplier 1: Digikey; Supplier Part Number 1: 1589-2044-1-ND; Manufacturer Part Number: MP6519GQ-Z; ComponentLink1Description: Datasheet; ComponentLink1URL: https://mm.digikey.com/Volume0/opasdata/d220001/medias/docus/696/MP6519_r1.01.pdf

## Sheet pmic_vicor_brick.SchDoc
size A
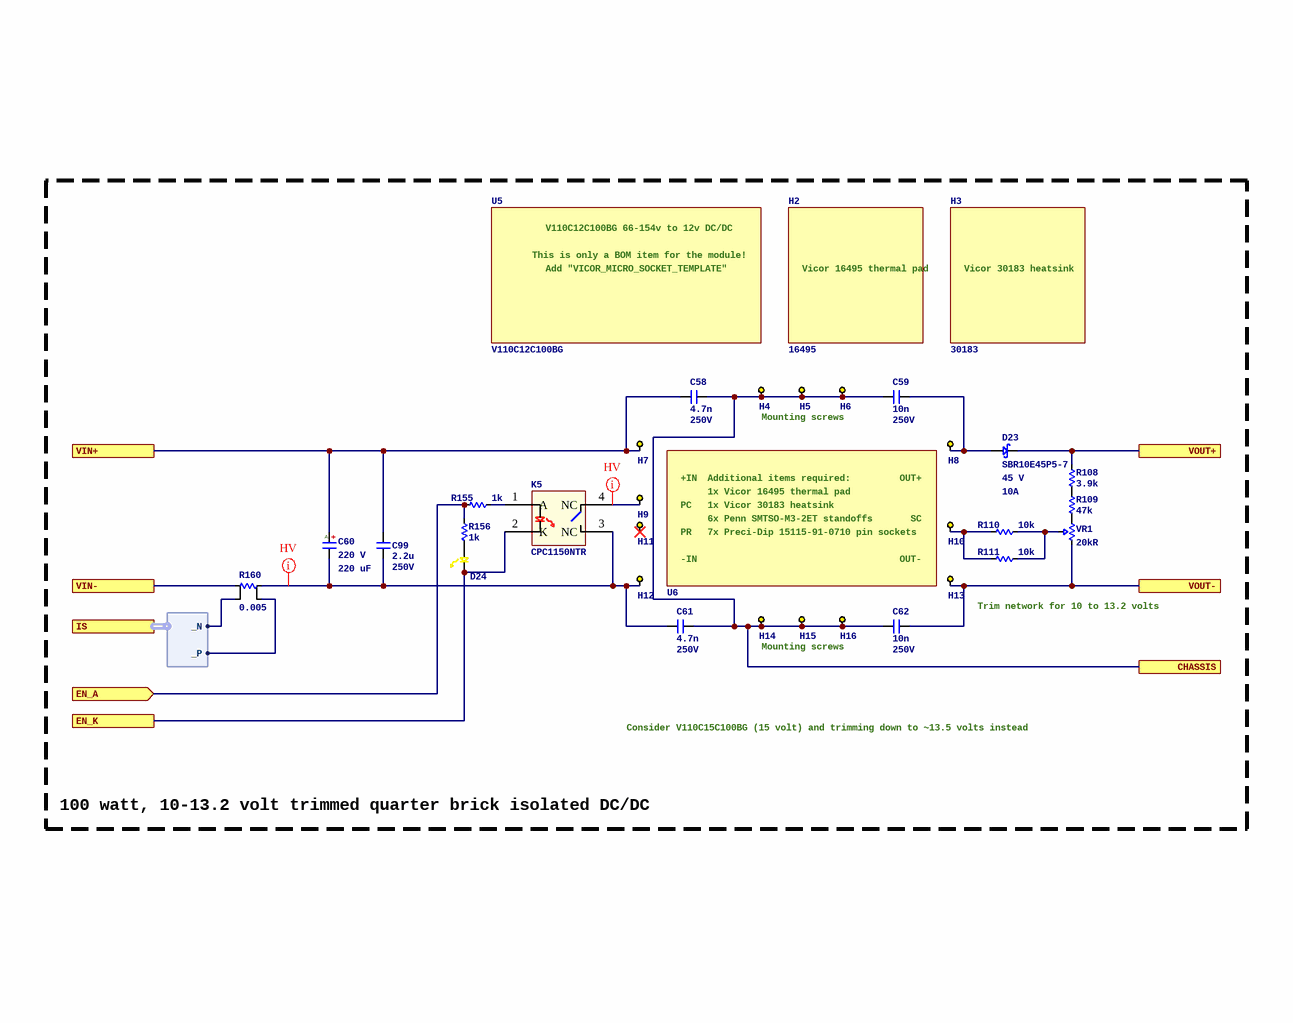
[diagram p15: pmic_vicor_brick.SchDoc]

### Parts
C58  Capacitance: 4.7n  Voltage Rating: 250V  [C0805]  (hidden comment: GCM21B5C2E472JX01L)
C59  Capacitance: 10n  Voltage Rating: 250V  [C0805]  (hidden comment: GRM21B5C2E103JWAAL)
C60  Voltage: 220 V  Capacitance: 220 uF  [CAP_1600X2700X750]  (hidden comment: EKXJ221ELL221MM25S)
C61  Capacitance: 4.7n  Voltage Rating: 250V  [C0805]  (hidden comment: GCM21B5C2E472JX01L)
C62  Capacitance: 10n  Voltage Rating: 250V  [C0805]  (hidden comment: GRM21B5C2E103JWAAL)
C99  Capacitance: 2.2u  Voltage Rating: 250V  [C2220]  (hidden comment: C5750X7T2E225KT000N)
D23  SBR10E45P5-7  Voltage: 45 V  Current: 10A  [POWERDI5]
D24  LTST-C190YKT  [LED_0603P_YELLOW]  (value not drawn)
H2  16495  (mechanical)
H3  30183  [VICOR_HEATSINK_30183]
H4  SMTSO-M3-2ET  [SMTSO-M3-2ET]  (value not drawn)
H5  SMTSO-M3-2ET  [SMTSO-M3-2ET]  (value not drawn)
H6  SMTSO-M3-2ET  [SMTSO-M3-2ET]  (value not drawn)
H7  15115-91-0710  [PRECI-DIP_15115-91-0710]  (value not drawn)
H8  15115-91-0710  [PRECI-DIP_15115-91-0710]  (value not drawn)
H9  15115-91-0710  [PRECI-DIP_15115-91-0710]  (value not drawn)
H10  15115-91-0710  [PRECI-DIP_15115-91-0710]  (value not drawn)
H11  15115-91-0710  [PRECI-DIP_15115-91-0710]  (value not drawn)
H12  15115-91-0710  [PRECI-DIP_15115-91-0710]  (value not drawn)
H13  15115-91-0710  [PRECI-DIP_15115-91-0710]  (value not drawn)
H14  SMTSO-M3-2ET  [SMTSO-M3-2ET]  (value not drawn)
H15  SMTSO-M3-2ET  [SMTSO-M3-2ET]  (value not drawn)
H16  SMTSO-M3-2ET  [SMTSO-M3-2ET]  (value not drawn)
K5  CPC1150NTR  [4SMD300]
R108  value 3.9k  [R0402]  (hidden comment: 0402WGF3901TCE)
R109  value 47k  [R0402]  (hidden comment: 0402WGF4702TCE)
R110  value 10k  [R0402]  (hidden comment: 0402WGF1002TCE)
R111  value 10k  [R0402]  (hidden comment: 0402WGF1002TCE)
R155  value 1k  [R0402]  (hidden comment: 0402WGF1001TCE)
R156  value 1k  [R0402]  (hidden comment: 0402WGF1001TCE)
R160  Resistance (Ohms): 0.005  [VISHAY_WSL2726]  (hidden comment: WSL27265L000FEB)
U5  V110C12C100BG  (mechanical)
U6  CONV_DCDC_VICOR_MICRO_SOCKET_TEMPLATE  [VICOR_MICRO_SOCKET_TEMPLATE]  (value not drawn)  (no BOM)
VR1  value 20kR  [TT_67W]  (hidden comment: 67WR20KLF)

### Ports
CHASSIS, EN_A (in), EN_K, IS (harness DIFF), VIN+, VIN-, VOUT+, VOUT-

### Harnesses
DIFF: _P, _N

### Nets
CHASSIS: C58.2 C59.1 C61.2 C62.1 H4.1 H5.1 H6.1 H14.1 H15.1 H16.1 ; port CHASSIS
GND: C62.2 D24.1 H13.1 K5.2(K) VR1.3 ; port EN_K, port VOUT-
HV_N: R160.1 ; port VIN-
HV_P: C58.1 C60.1 C99.1 H7.1 ; port VIN+
LVB: D23.2 R108.2 ; port VOUT+
DCDC_IS._N: R160.3 ; port IS._N
DCDC_IS._P: R160.4 ; port IS._P
HV_BUCK_EN: R155.2 R156.1 ; port EN_A
NetC59_2: C59.2 D23.1 H8.1
NetC60_2: C60.2 C61.1 C99.2 H12.1 K5.3(NC) R160.2
NetD24_2: D24.2 R156.2
NetH9_1: H9.1 K5.4(NC)
NetH10_1: H10.1 R110.1 R111.1
NetK5_1: K5.1(A) R155.1
NetR108_1: R108.1 R109.1
NetR109_2: R109.2 VR1.1
NetR110_2: R110.2 R111.2 VR1.2

Not connected (* = marked no-connect by the designer): H11 1*

### Layout directives
net class HV: NetC60_2, NetH9_1

### Notes on the sheet
- Mounting screws
- Trim network for 10 to 13.2 volts
- Consider V110C15C100BG (15 volt) and trimming down to ~13.5 volts instead
- 100 watt, 10-13.2 volt trimmed quarter brick isolated DC/DC
- (in symbol AUTO_CAP_ALUM_220UF_220V_EKXJ221ELL221MM25S) A; +
- (in symbol CONV_DCDC_V110C12C100BG_BOM) V110C12C100BG 66-154v to 12v DC/DC; This is only a BOM item for the module!; Add "VICOR_MICRO_SOCKET_TEMPLATE"
- (in symbol CONV_DCDC_VICOR_MICRO_SOCKET_TEMPLATE) +IN; Additional items required:; OUT+; 1x Vicor 16495 thermal pad; PC; 1x Vicor 30183 heatsink; 6x Penn SMTSO-M3-2ET standoffs; SC; PR; 7x Preci-Dip 15115-91-0710 pin sockets; -IN; OUT-
- (in symbol VICOR_HEATSINK_30183) Vicor 30183 heatsink
- (in symbol VICOR_THERMAL_PAD_16495) Vicor 16495 thermal pad

### Library data of the parts
C58 C61 = GCM21B5C2E472JX01L: Manufacturer: Murata Electronics; Dielectric: C0G; Manufacturer Part Number: GCM21B5C2E472JX01L; ComponentLink1URL: https://wmsc.lcsc.com/wmsc/upload/file/pdf/v2/lcsc/1912111437_Murata-Electronics-GCM21B5C2E472JX01L_C415370.pdf; ComponentLink1Description: Datasheet; Package: 0805; Supplier 2: LCSC; Supplier Part Number 2: C415370
C59 C62 = GRM21B5C2E103JWAAL: Manufacturer: Murata Electronics; Dielectric: C0G; Manufacturer Part Number: GRM21B5C2E103JWAAL; ComponentLink1URL: https://wmsc.lcsc.com/wmsc/upload/file/pdf/v2/lcsc/2308111754_Murata-Electronics-GRM21B5C2E103JWAAL_C3870620.pdf; ComponentLink1Description: Datasheet; Package: 0805; Supplier 2: LCSC; Supplier Part Number 2: C3870620
C60 = AUTO_CAP_ALUM_220UF_220V_EKXJ221ELL221MM25S: Aluminum Electrolytic Capacitor, Polarized, Aluminum (wet), 220V, 20% +Tol, 20% -Tol, 220uF, Through Hole Mount; Manufacturer: United Chemi-Con; Manufacturer Part Number: EKXJ221ELL221MM25S; ComponentLink4URL: http://www.chemi-con.co.jp/cgi-bin/CAT_DB/SEARCH/cat_db_al.cgi?e=e&amp;j=p&amp;pdfname=kxj; ComponentLink4Description: Datasheet; Supplier 1: Digikey; Supplier Part Number 1: 565-EKXJ221ELL221MM25S-ND; Supplier 2: LCSC; Supplier Part Number 2: C1600234
C99 = C5750X7T2E225KT000N: Manufacturer: TDK; Dielectric: X7T; ComponentLink1URL: https://wmsc.lcsc.com/wmsc/upload/file/pdf/v2/lcsc/2304140030_TDK-C5750X7T2E225KT000N_C435266.pdf; ComponentLink1Description: Datasheet; Manufacturer Part Number: C5750X7T2E225KT000N; Package: 2220; Supplier 2: LCSC; Supplier Part Number 2: C435266
D23 = SCHOTTKY_45V_SBR10E45P5-7: Rectifier Diode, 1 Phase, 1 Element, 10A, 45V V(RRM), Silicon; Manufacturer: Diodes; Supplier 1: Digikey; Supplier Part Number 1: SBR10E45P5-7DICT-ND; Manufacturer Part Number: SBR10E45P5-7; ComponentLink1Description: Datasheet; ComponentLink1URL: https://www.diodes.com/assets/Datasheets/SBR10E45P5.pdf; Supplier 2: LCSC; Supplier Part Number 2: C73569
D24 = LED_0603_YELLOW_LTST-C190YKT: as D18 on sheet hv_bleed; Supplier 1: Digikey; ComponentLink1URL: https://mm.digikey.com/Volume0/opasdata/d220001/medias/docus/1176/LTST-C190YKT.pdf; ComponentLink1Description: Datasheet; Supplier Part Number 1: 160-1184-1-ND; Manufacturer Part Number: LTST-C190YKT; Supplier 2: LCSC; Supplier Part Number 2: C125097
H2 = VICOR_THERMAL_PAD_16495: Heat Sink, Aluminum; Manufacturer: Vicor; Supplier 1: Digikey; Supplier Part Number 1: 1102-1560-ND; Manufacturer Part Number: 16495; ComponentLink1Description: Drawing; ComponentLink1URL: https://asp.vicorpower.com/CADPDF/Q6T45D.PDF; Supplier 2: Mouser; Supplier Part Number 2: 492-16495
H3 = VICOR_HEATSINK_30183: Heat Sink, Aluminum; Manufacturer: Vicor; Supplier 1: Digikey; Supplier Part Number 1: 1102-1595-ND; Manufacturer Part Number: 30183; ComponentLink1Description: Drawing; ComponentLink1URL: https://asp.vicorpower.com/CADPDF/Q6T45D.PDF; Supplier 2: Mouser; Supplier Part Number 2: 492-30183
H4-H6 H14-H16 = STANDOFF_SMTSO-M3-2ET: Standoff Round Swage F/F M3 X 0.5-THD Carbon Steel Electro-Tin ASTM B545; Manufacturer: PennEngineering; Supplier 1: Mouser; Supplier Part Number 1: 153-SMTSO-M3-2ET; Manufacturer Part Number: SMTSO-M3-2ET; Supplier 2: LCSC; Supplier Part Number 2: C18212183
H7-H13 = PIN_SOCKET_15115-91-0710: Pin Receptacle Connector 0.078" ~ 0.096" (1.98mm ~ 2.44mm) No Tail Solder; Manufacturer: Preci-Dip; Supplier 1: Digikey; Supplier Part Number 1: 1212-15115-91-0710-ND; Manufacturer Part Number: 15115-91-0710; Supplier 2: LCSC; Supplier Part Number 2: C20239898
K5 = SSR_350V_CPC1150NTR: CPC1150N Series SPST 120 mA 350 V Single Channel Solid State Relay SMT - SOIC-4; Manufacturer: Littelfuse; Supplier 1: Digikey; Supplier Part Number 1: 5656-CPC1150NTRCT-ND; Manufacturer Part Number: CPC1150NTR; ComponentLink1URL: https://www.littelfuse.com/media?resourcetype=datasheets&itemid=7f3e9a05-5c4a-493e-bfe5-2075df32c7f9&filename=littelfuse-integrated-circuits-cpc1150n-series-datasheet; ComponentLink1Description: Datasheet; Supplier 2: LCSC; Supplier Part Number 2: C5299824
R108 = 0402WGF3901TCE: Manufacturer: UNI-ROYAL(Uniroyal Elec); Tolerance: 1%; Temperature Coefficient: Â±100ppm/â„ƒ; Power Rating (mW): 62.5; Manufacturer Part Number: 0402WGF3901TCE; ComponentLink1Description: Datasheet; ComponentLink1URL: https://wmsc.lcsc.com/wmsc/upload/file/pdf/v2/lcsc/2206010000_UNI-ROYAL-Uniroyal-Elec-0402WGF3901TCE_C51721.pdf; Package: 0402; Supplier 2: LCSC; Supplier Part Number 2: C51721
R109 = 0402WGF4702TCE: as R113 on sheet hv_bleed; Manufacturer Part Number: 0402WGF4702TCE; ComponentLink1Description: Datasheet; ComponentLink1URL: https://wmsc.lcsc.com/wmsc/upload/file/pdf/v2/lcsc/2206010100_UNI-ROYAL-Uniroyal-Elec-0402WGF4702TCE_C25792.pdf; Package: 0402; Supplier 2: LCSC; Supplier Part Number 2: C25792
R110 R111 = 0402WGF1002TCE: as R75 on sheet adc_mcp3913; Manufacturer Part Number: 0402WGF1002TCE; ComponentLink1Description: Datasheet; ComponentLink1URL: https://wmsc.lcsc.com/wmsc/upload/file/pdf/v2/lcsc/2206010100_UNI-ROYAL-Uniroyal-Elec-0402WGF1002TCE_C25744.pdf; Package: 0402; Supplier 2: LCSC; Supplier Part Number 2: C25744
R155 R156 = 0402WGF1001TCE: as R104 on sheet filter_diff_shunt; ComponentLink1Description: Datasheet; ComponentLink1URL: https://wmsc.lcsc.com/wmsc/upload/file/pdf/v2/lcsc/2206010216_UNI-ROYAL-Uniroyal-Elec-0402WGF1001TCE_C11702.pdf; Manufacturer Part Number: 0402WGF1001TCE; Package: 0402; Supplier 2: LCSC; Supplier Part Number 2: C11702
R160 = RES_CURRENT_SENSE_0.005_OHM_1%_3W_2726_WSL27265L000FEB: as R90 on sheet hv_architecture; Supplier 1: Digikey; Manufacturer Part Number: WSL27265L000FEB; ComponentLink1URL: http://www.vishay.com/docs/30131/wsl2726.pdf; ComponentLink1Description: Datasheet; Supplier Part Number 1: WSLQ-.005CT-ND; Supplier 2: LCSC; Supplier Part Number 2: C1517421
U5 = CONV_DCDC_V110C12C100BG_BOM: APSM DCDC, 1 Output, 100W, Hybrid; Manufacturer: Vicor; Supplier 1: Digikey; Supplier Part Number 1: V110C12C100BG-ND; Manufacturer Part Number: V110C12C100BG; ComponentLink2URL: https://www.vicorpower.com/documents/datasheets/ds_110vin-micro-family.pdf; ComponentLink2Description: Datasheet; ComponentLink3Description: Application guide; ComponentLink3URL: https://www.vicorpower.com/documents/applications_manual/fas_trak_apps_manual.pdf
U6 = CONV_DCDC_VICOR_MICRO_SOCKET_TEMPLATE: This is a template for the placement of socket pins and heatsink for a Vicor micro brick
VR1 = POT_67WR20KLF: Trimmer, Cermet, 0.5W, 20000ohm, 200V, 10% +/-Tol, 100ppm/Cel, 20 Turn(s); Manufacturer: TT BI; Supplier 1: Digikey; Supplier Part Number 1: 987-1090-ND; Manufacturer Part Number: 67WR20KLF; ComponentLink1Description: Datasheet; ComponentLink1URL: https://www.ttelectronics.com/TTElectronics/media/ProductFiles/Datasheet/67.pdf; Supplier 2: LCSC; Supplier Part Number 2: C6826039